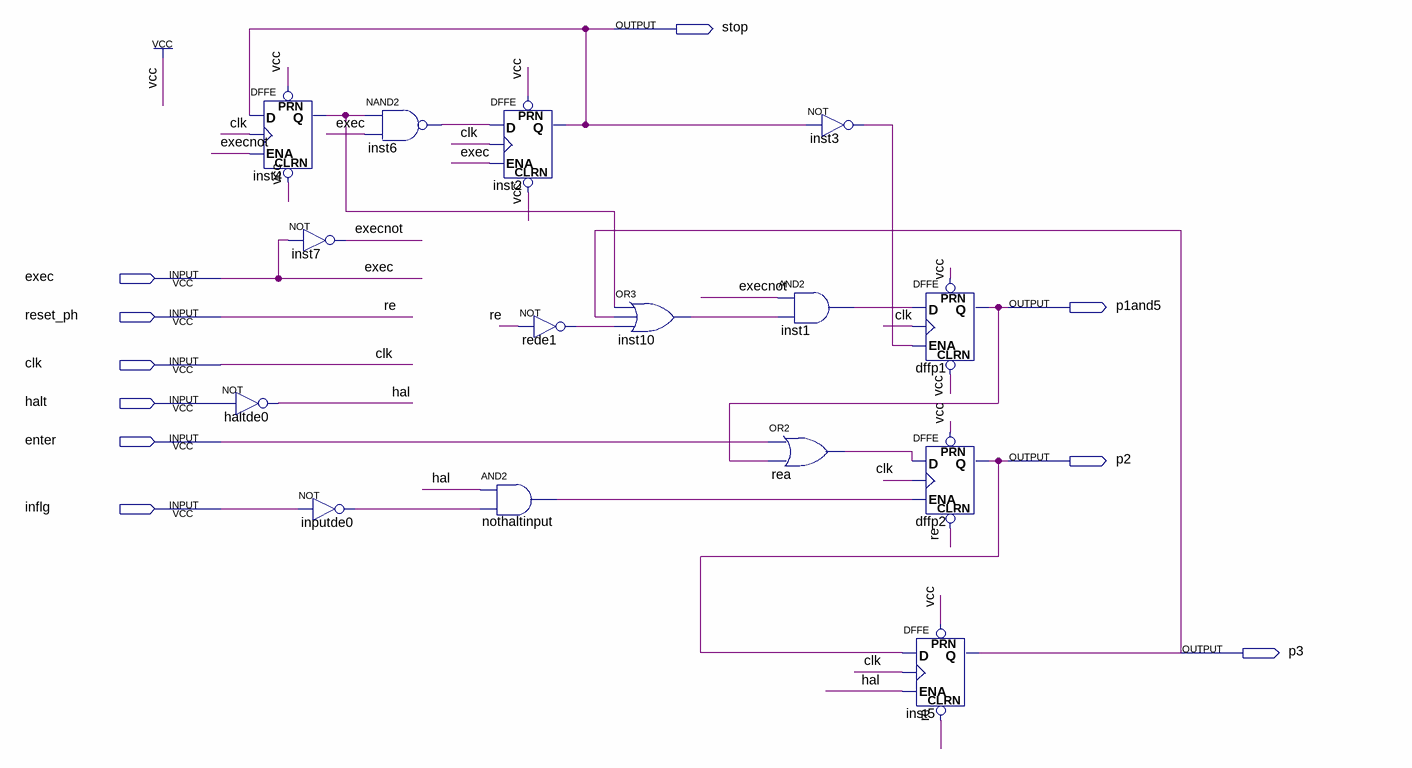
[diagram p0: schematic sheet]
// Quartus schematic phazecounter.bdf as structural Verilog: 15 symbols, 10 pins
module phazecounter (
  input  exec,
  input  reset_ph,
  input  clk,
  input  halt,
  input  enter,
  input  inflg,
  output stop,
  output p1and5,
  output p2,
  output p3
);

  wire execnot, hal, inputde0_out, inst1_out, inst3_out, inst4_q, inst6_out, inst10_out, nothaltinput_out,
       rea_out, rede1_out;

  DFFE inst4 (.PRN(1'b1), .CLRN(1'b1), .D(stop), .CLK(clk), .ENA(execnot), .Q(inst4_q));
  not haltde0 (hal, halt);
  not inst7 (execnot, exec);
  not inputde0 (inputde0_out, inflg);
  nand inst6 (inst6_out, inst4_q, exec);
  DFFE inst2 (.PRN(1'b1), .CLRN(1'b1), .D(inst6_out), .CLK(clk), .ENA(exec), .Q(stop));
  and nothaltinput (nothaltinput_out, hal, inputde0_out);
  not rede1 (rede1_out, reset_ph);
  or inst10 (inst10_out, inst4_q, p3, rede1_out);
  not inst3 (inst3_out, stop);
  and inst1 (inst1_out, execnot, inst10_out);
  or rea (rea_out, enter, p1and5);
  DFFE dffp1 (.PRN(1'b1), .CLRN(1'b1), .D(inst1_out), .CLK(clk), .ENA(inst3_out), .Q(p1and5));
  DFFE dffp2 (.PRN(1'b1), .CLRN(reset_ph), .D(rea_out), .CLK(clk), .ENA(nothaltinput_out), .Q(p2));
  DFFE inst5 (.PRN(1'b1), .CLRN(reset_ph), .D(p2), .CLK(clk), .ENA(hal), .Q(p3));

  // Other names for the same wires on the sheet: re = reset_ph
endmodule
